# Altium schematic sheet motorController.SchDoc
size A4
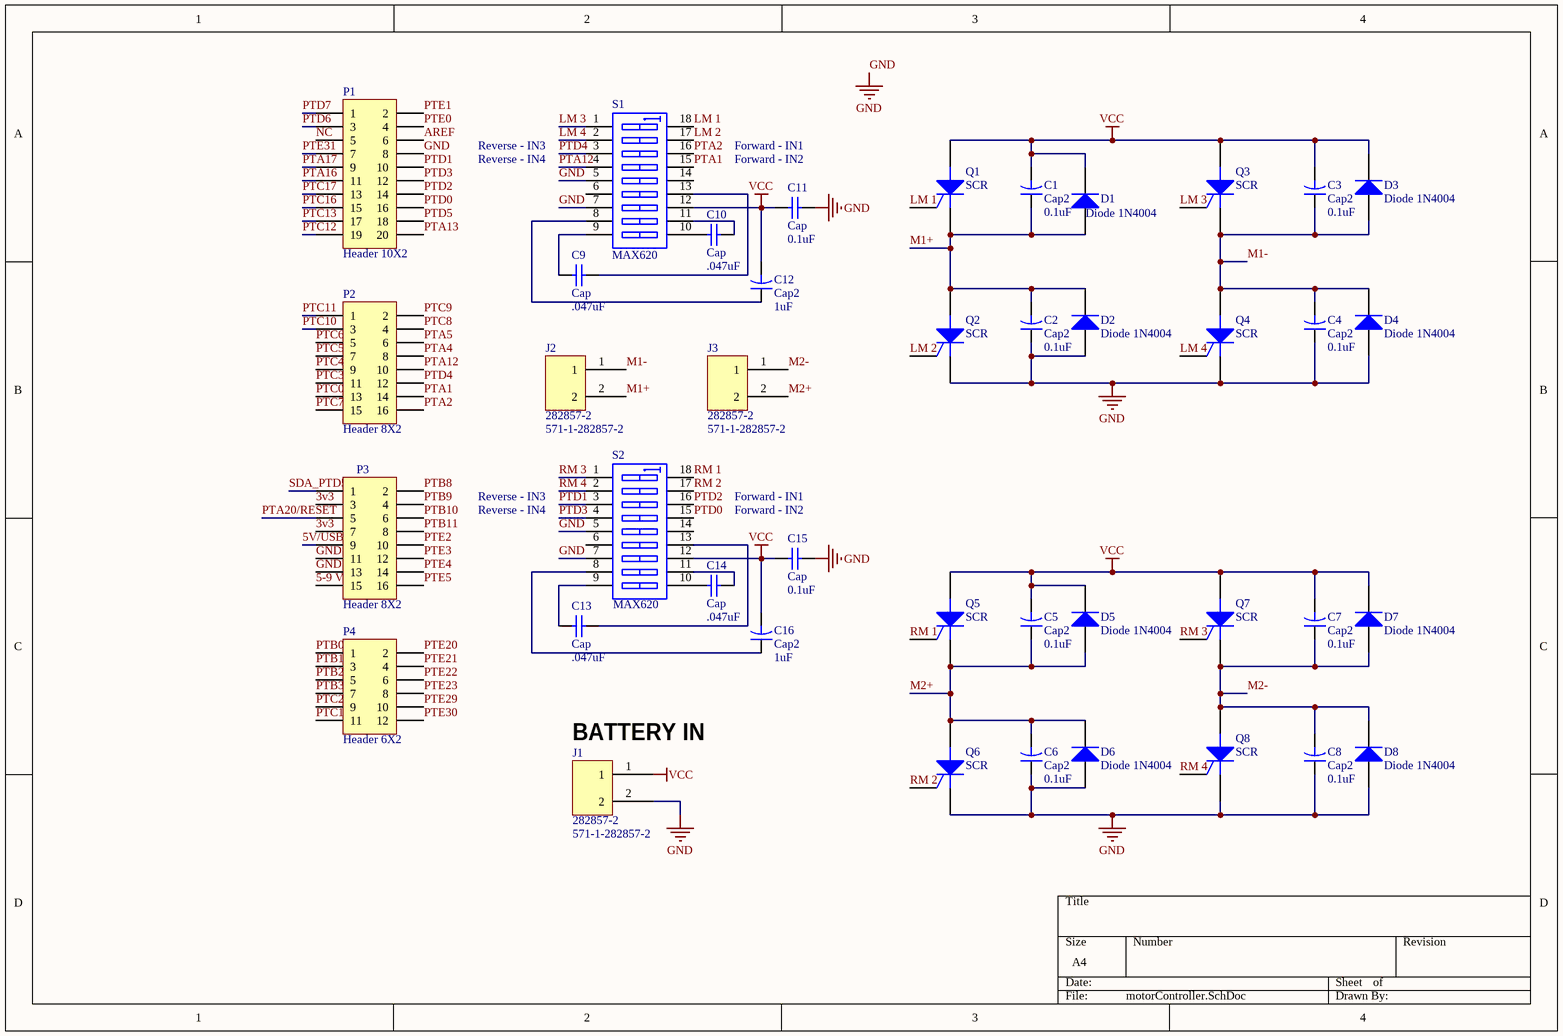
[diagram p0: motorController.SchDoc]

## Parts
C1  Cap2  value 0.1uF  [CAPR5-4X5]
C2  Cap2  value 0.1uF  [CAPR5-4X5]
C3  Cap2  value 0.1uF  [CAPR5-4X5]
C4  Cap2  value 0.1uF  [CAPR5-4X5]
C5  Cap2  value 0.1uF  [CAPR5-4X5]
C6  Cap2  value 0.1uF  [CAPR5-4X5]
C7  Cap2  value 0.1uF  [CAPR5-4X5]
C8  Cap2  value 0.1uF  [CAPR5-4X5]
C9  Cap  value .047uF  [RAD-0.3]
C10  Cap  value .047uF  [RAD-0.3]
C11  Cap  value 0.1uF  [RAD-0.3]
C12  Cap2  value 1uF  [CAPR5-4X5]
C13  Cap  value .047uF  [RAD-0.3]
C14  Cap  value .047uF  [RAD-0.3]
C15  Cap  value 0.1uF  [RAD-0.3]
C16  Cap2  value 1uF  [CAPR5-4X5]
D1  Diode 1N4004  [DO-41]
D2  Diode 1N4004  [DO-41]
D3  Diode 1N4004  [DO-41]
D4  Diode 1N4004  [DO-41]
D5  Diode 1N4004  [DO-41]
D6  Diode 1N4004  [DO-41]
D7  Diode 1N4004  [DO-41]
D8  Diode 1N4004  [DO-41]
J1  282857-2  Supplier Part Number 1: 571-1-282857-2  [282857-2]
J2  282857-2  Supplier Part Number 1: 571-1-282857-2  [282857-2]
J3  282857-2  Supplier Part Number 1: 571-1-282857-2  [282857-2]
P1  Header 10X2  [HDR2X10]
P2  Header 8X2  [HDR2X8]
P3  Header 8X2  [HDR2X8]
P4  Header 6X2  [HDR2X6]
Q1  SCR  [TO-220-AB]
Q2  SCR  [TO-220-AB]
Q3  SCR  [TO-220-AB]
Q4  SCR  [TO-220-AB]
Q5  SCR  [TO-220-AB]
Q6  SCR  [TO-220-AB]
Q7  SCR  [TO-220-AB]
Q8  SCR  [TO-220-AB]
S1  MAX620  [DIP-18]
S2  MAX620  [DIP-18]

## Nets
GND: C2.1 C4.1 C6.1 C8.1 C11.2 C15.2 D2.1(A) D4.1(A) D6.1(A) D8.1(A) J1.2 P1.8 P3.11 P3.13 Q2.3(K) Q4.3(K) Q6.3(K) Q8.3(K) S1.5(A5) S1.7(A7) S2.5(A5) S2.7(A7)
VCC: C1.2 C3.2 C5.2 C7.2 C11.1 C12.2 C15.1 C16.2 D1.2(K) D3.2(K) D5.2(K) D7.2(K) J1.1 Q1.1(A) Q3.1(A) Q5.1(A) Q7.1(A) S1.12(B7) S2.12(B7)
3v3: P3.3 P3.7
5-9 Vin: P3.15
5V/USB: P3.9
AREF: P1.6
LM 1: Q1.2(G) S1.18(B1)
LM 2: Q2.2(G) S1.17(B2)
LM 3: Q3.2(G) S1.1(A1)
LM 4: Q4.2(G) S1.2(A2)
M1+: C1.1 C2.2 D1.1(A) D2.2(K) J2.2 Q1.3(K) Q2.1(A)
M1-: C3.1 C4.2 D3.1(A) D4.2(K) J2.1 Q3.3(K) Q4.1(A)
M2+: C5.1 C6.2 D5.1(A) D6.2(K) J3.2 Q5.3(K) Q6.1(A)
M2-: C7.1 C8.2 D7.1(A) D8.2(K) J3.1 Q7.3(K) Q8.1(A)
NC: P1.5
PTA1: P2.14 S1.15(B4)
PTA2: P2.16 S1.16(B3)
PTA4: P2.8
PTA5: P2.6
PTA12: P2.10 S1.4(A4)
PTA13: P1.20
PTA16: P1.11
PTA17: P1.9
PTA20/RESET: P3.5
PTB0: P4.1
PTB1: P4.3
PTB2: P4.5
PTB3: P4.7
PTB8: P3.2
PTB9: P3.4
PTB10: P3.6
PTB11: P3.8
PTC0: P2.13
PTC1: P4.11
PTC2: P4.9
PTC3: P2.11
PTC4: P2.9
PTC5: P2.7
PTC6: P2.5
PTC7: P2.15
PTC8: P2.4
PTC9: P2.2
PTC10: P2.3
PTC11: P2.1
PTC12: P1.19
PTC13: P1.17
PTC16: P1.15
PTC17: P1.13
PTD0: P1.16 S2.15(B4)
PTD1: P1.10 S2.3(A3)
PTD2: P1.14 S2.16(B3)
PTD3: P1.12 S2.4(A4)
PTD4: P2.12 S1.3(A3)
PTD5: P1.18
PTD6: P1.3
PTD7: P1.1
PTE0: P1.4
PTE1: P1.2
PTE2: P3.10
PTE3: P3.12
PTE4: P3.14
PTE5: P3.16
PTE20: P4.2
PTE21: P4.4
PTE22: P4.6
PTE23: P4.8
PTE29: P4.10
PTE30: P4.12
PTE31: P1.7
RM 1: Q5.2(G) S2.18(B1)
RM 2: Q6.2(G) S2.17(B2)
RM 3: Q7.2(G) S2.1(A1)
RM 4: Q8.2(G) S2.2(A2)
SDA_PTD5: P3.1
NetC9_1: C9.1 S1.9(A9)
NetC9_2: C9.2 S1.13(B6)
NetC10_1: C10.1 S1.10(B9)
NetC10_2: C10.2 S1.11(B8)
NetC12_1: C12.1 S1.8(A8)
NetC13_1: C13.1 S2.9(A9)
NetC13_2: C13.2 S2.13(B6)
NetC14_1: C14.1 S2.10(B9)
NetC14_2: C14.2 S2.11(B8)
NetC16_1: C16.1 S2.8(A8)

Not connected (* = marked no-connect by the designer): S1 6(A6) 14(B5); S2 6(A6) 14(B5)

## Notes on the sheet
- Reverse - IN3
- Reverse - IN4
- Forward - IN1
- (near C11) Forward - IN2
- (near C15) Forward - IN2
- (near J1) BATTERY IN

## Library data of the parts
C1-C8 C12 C16 = Cap2: Capacitor; Published: 23-Sep-2002; PackageReference: CAPR5-4X5; Publisher: Altium Limited; PackageDescription: Capacitor; 2 Leads
C9-C11 C13-C15 = Cap: Capacitor; Published: 8-Jun-2000; LatestRevisionDate: 17-Jul-2002; LatestRevisionNote: Re-released for DXP Platform.; PackageReference: RAD-0.3; Publisher: Altium Limited; PackageDescription: Radial Cap, Thru-Hole; 2 Leads; 0.3 in Pin Spacing
D1-D8 = Diode 1N4004: 1 Amp General Purpose Rectifier; Published: 8-Jun-2000; LatestRevisionDate: 17-Jul-2002; LatestRevisionNote: Re-released for DXP Platform.; DatasheetVersion: 1998; PackageVersion: Aug-1999; PackageReference: DO-41; Publisher: Altium Limited; PackageDescription: Diode, Axial; Body 5.2 x 2.7 mm (LxDia. max), Lead Dia. 0.86 mm (max); Code_JEDEC: DO-204-AL; ComponentLink1Description: Manufacturer Link; ComponentLink1URL: http://www.fairchildsemi.com/; ComponentLink2Description: Datasheet; ComponentLink2URL: http://www.fairchildsemi.com/ds/1N%2F1N4001.pdf
P1 = Header 10X2: Header, 10-Pin, Dual row; LatestRevisionDate: 17-Jul-2002; LatestRevisionNote: Re-released for DXP Platform.; Publisher: Altium Limited
P2 P3 = Header 8X2: Header, 8-Pin, Dual row; LatestRevisionDate: 17-Jul-2002; LatestRevisionNote: Re-released for DXP Platform.; Publisher: Altium Limited
P4 = Header 6X2: Header, 6-Pin, Dual row; LatestRevisionDate: 17-Jul-2002; LatestRevisionNote: Re-released for DXP Platform.; Publisher: Altium Limited
Q1-Q8 = SCR: Silicon Controlled Rectifier; Published: 8-Jun-2000; LatestRevisionDate: 17-Jul-2002; LatestRevisionNote: Re-released for DXP Platform.; PackageReference: TO-220-AB; Publisher: Altium Limited; Code_JEDEC: TO-220-AB
S1 S2 = SW DIP-9: DIP Switch, 9 Position, SPST; Published: 24-Mar-1999; LatestRevisionDate: 17-Jul-2002; LatestRevisionNote: Re-released for DXP Platform.; PackageReference: DIP-18; Publisher: Altium Limited; Code_JEDEC: MO-036-AE
J1-J3 = 282857-2: Supplier 1: Mouser